# EAGLE design Adafruit_Pro_Trinket_3v3_modified (EAGLE 6.4)
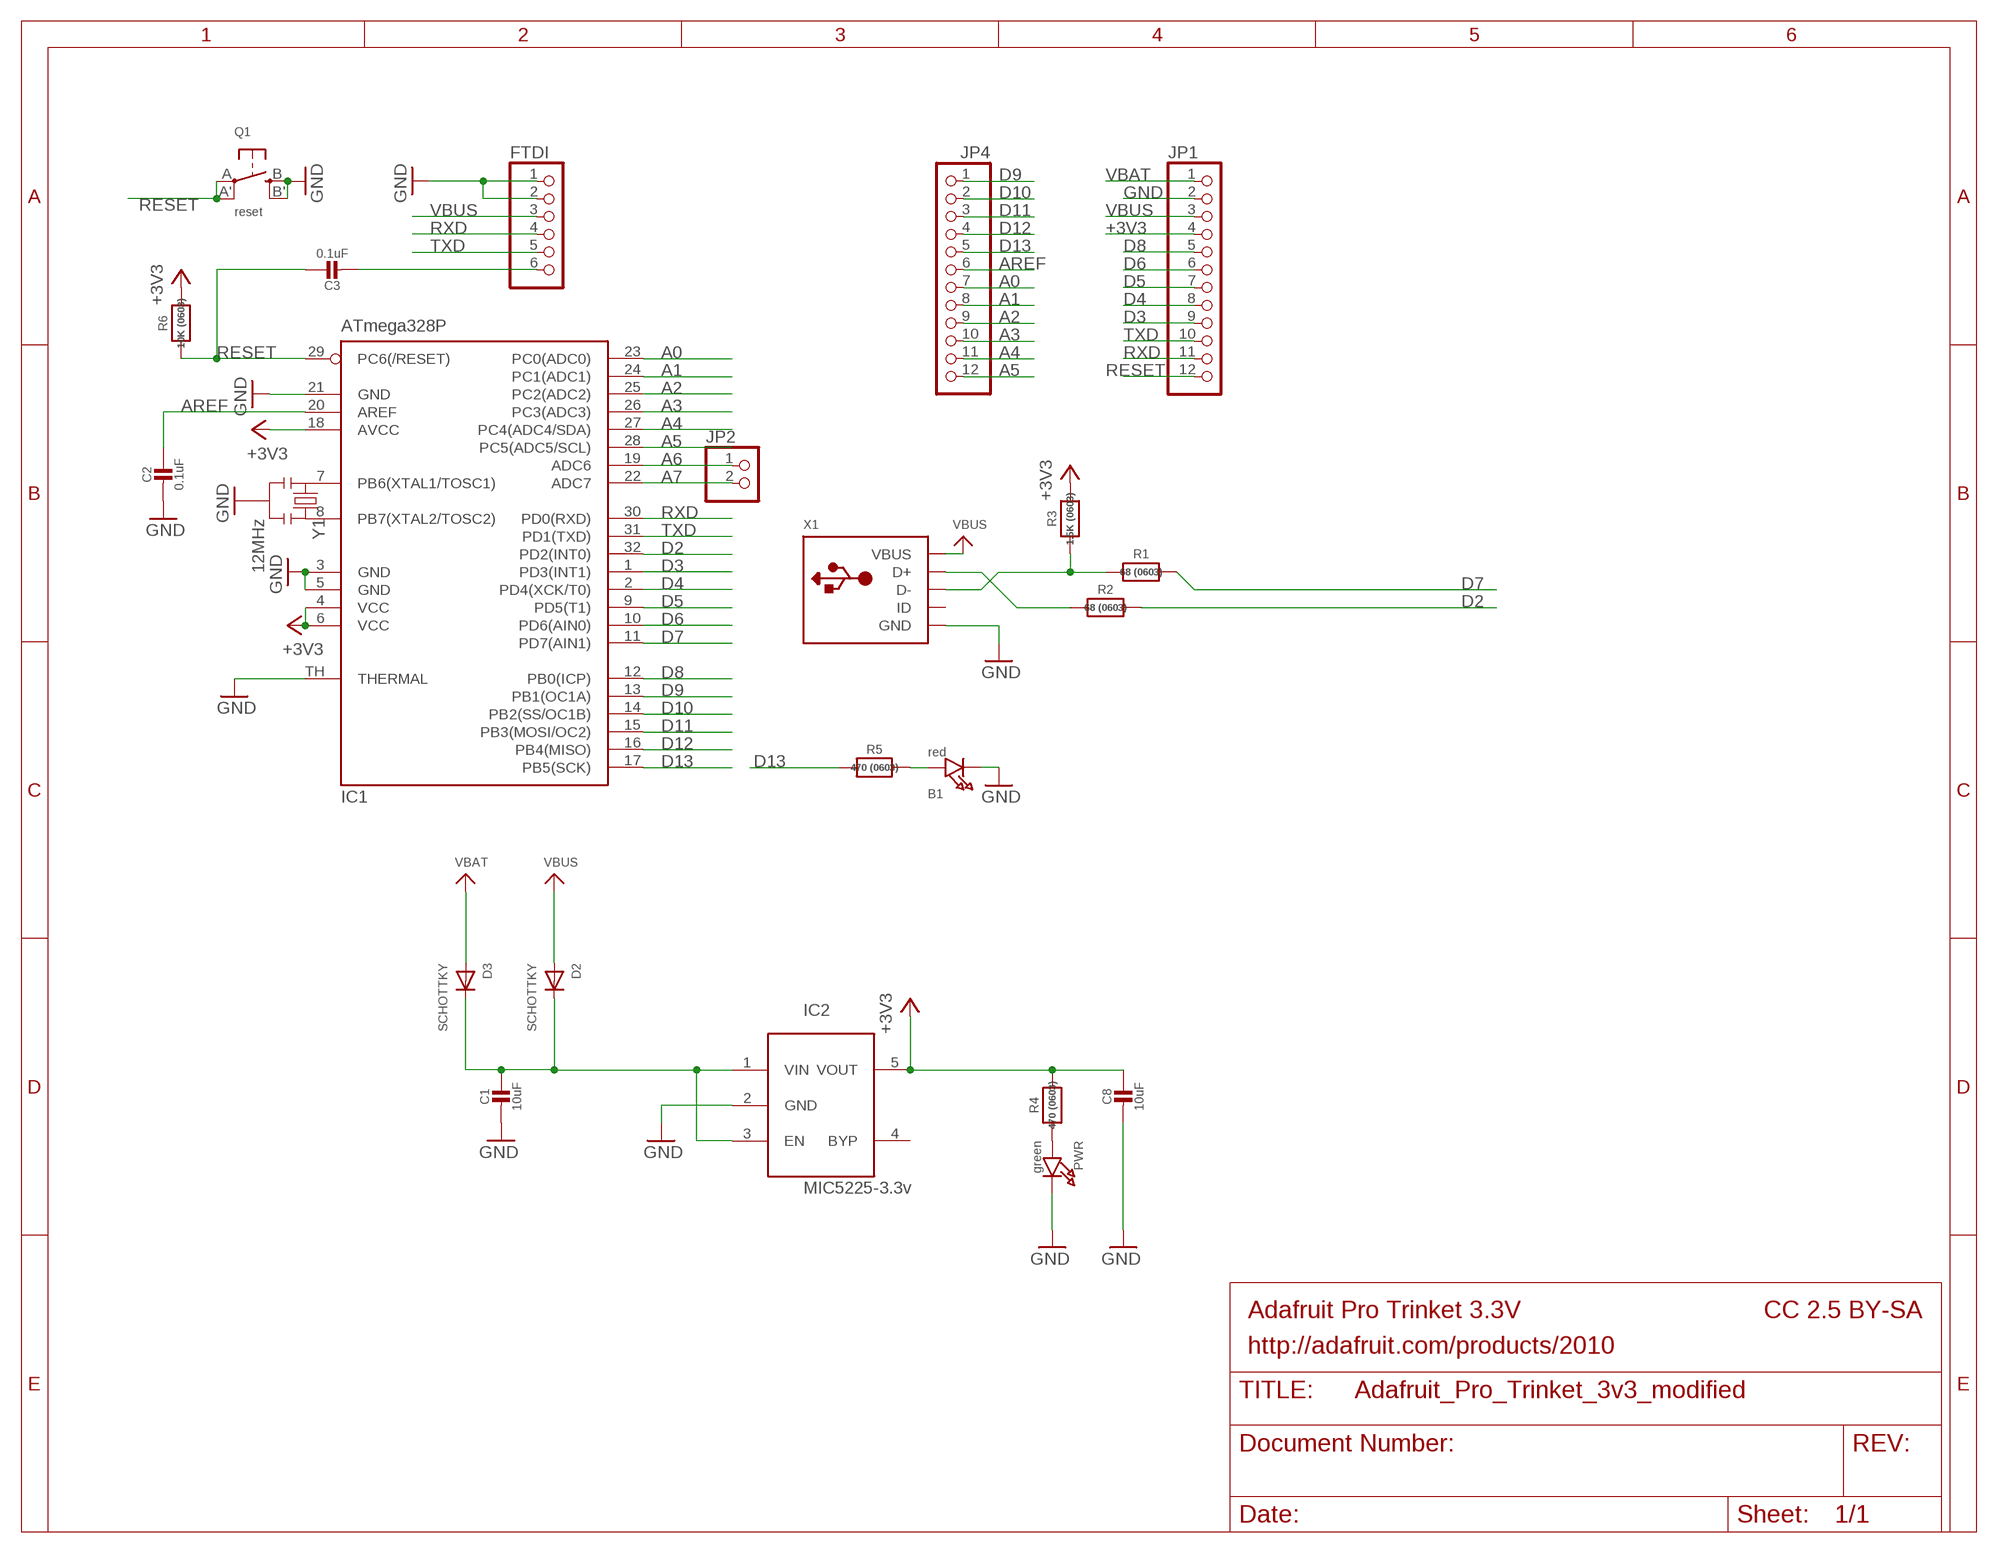
[diagram p0: schematic, sheet 1]

## Parts
B1  red  LED0805_NOOUTLINE  [CHIPLED_0805_NOOUTLINE]
C1  10uF  CAP_CERAMIC0805-NOOUTLINE  [0805-NO]
C2  0.1uF  CAP_CERAMIC_0805MP  [_0805MP]
C3  0.1uF  CAP_CERAMIC0805-NOOUTLINE  [0805-NO]
C8  10uF  CAP_CERAMIC0805-NOOUTLINE  [0805-NO]
D2  SCHOTTKY  ADAFRUIT_DIODE_SOD-123FL  [ADAFRUIT_SOD-123FL]
D3  SCHOTTKY  ADAFRUIT_DIODE_SOD-123FL  [ADAFRUIT_SOD-123FL]
FTDI  PINHD-1X6CB  [1X06-CLEANBIG]
IC1  ATmega328P  MEGA8-MI  [MLF32-TH]
IC2  MIC5225-3.3v  LP298XS  [SOT23-5L]
JP1  PINHD-1X12-CB  [1X12-CB]
JP2  HEADER-1X2ROUND  [1X02_ROUND]
JP4  PINHD-1X12-CB  [1X12-CB]
PWR  green  LED0805_NOOUTLINE  [CHIPLED_0805_NOOUTLINE]
Q1  reset  SWITCH_TACT_SMT4.6X2.8  [BTN_KMR2_4.6X2.8]
R1  68 (0603)  RESISTOR_0603_NOOUT  [0603-NO]
R2  68 (0603)  RESISTOR_0603_NOOUT  [0603-NO]
R3  1.5K (0603)  RESISTOR_0603_NOOUT  [0603-NO]
R4  470 (0603)  RESISTOR_0603_NOOUT  [0603-NO]
R5  470 (0603)  RESISTOR_0603_NOOUT  [0603-NO]
R6  10K (0603)  RESISTOR0805_NOOUTLINE  [0805-NO]
X1  MICROBUILDER_USBMICRO_20329  [MICROBUILDER_4UCONN_20329]
Y1  12MHz  RESONATORSMD  [RESONATOR-SMD]

## Nets
+3V3: C8.1 IC1.4(VCC) IC1.6(VCC) IC1.18(AVCC) IC2.5(VOUT) JP1.4 R3.2 R4.2 R6.2
A0: IC1.23(PC0(ADC0)) JP4.7
A1: IC1.24(PC1(ADC1)) JP4.8
A2: IC1.25(PC2(ADC2)) JP4.9
A3: IC1.26(PC3(ADC3)) JP4.10
A4: IC1.27(PC4(ADC4/SDA)) JP4.11
A5: IC1.28(PC5(ADC5/SCL)) JP4.12
A6: IC1.19(ADC6) JP2.1
A7: IC1.22(ADC7) JP2.2
AREF: C2.1 IC1.20(AREF) JP4.6
D2: IC1.32(PD2(INT0)) R2.2
D3: IC1.1(PD3(INT1)) JP1.9
D4: IC1.2(PD4(XCK/T0)) JP1.8
D5: IC1.9(PD5(T1)) JP1.7
D6: IC1.10(PD6(AIN0)) JP1.6
D7: IC1.11(PD7(AIN1)) R1.2
D8: IC1.12(PB0(ICP)) JP1.5
D9: IC1.13(PB1(OC1A)) JP4.1
D10: IC1.14(PB2(SS/OC1B)) JP4.2
D11: IC1.15(PB3(MOSI/OC2)) JP4.3
D12: IC1.16(PB4(MISO)) JP4.4
D13: IC1.17(PB5(SCK)) JP4.5 R5.2
D+: R2.1 X1.D+
D-: R1.1 R3.1 X1.D-
DTR/RTS: C3.2 FTDI.6
GND: B1.C C1.2 C2.2 C8.2 FTDI.1 FTDI.2 IC1.3(GND) IC1.5(GND) IC1.21(GND) IC1.TH(THERMAL) IC2.2(GND) JP1.2 PWR.C Q1.B'(S1) Q1.B(S) X1.BASE@1(GND) X1.BASE@2(GND) X1.GND X1.SPRT@1(GND) X1.SPRT@2(GND) X1.SPRT@3(GND) X1.SPRT@4(GND) Y1.2
N$1: B1.A R5.1
N$2: IC1.8(PB7(XTAL2/TOSC2)) Y1.3
N$3: IC1.7(PB6(XTAL1/TOSC1)) Y1.1
N$6: PWR.A R4.1
N$7: C1.1 D2.C D3.C IC2.1(VIN) IC2.3(EN)
RESET: C3.1 IC1.29(PC6(/RESET)) JP1.12 Q1.A'(P1) Q1.A(P) R6.1
RXD: FTDI.4 IC1.30(PD0(RXD)) JP1.11
TXD: FTDI.5 IC1.31(PD1(TXD)) JP1.10
VBAT [power]: D3.A JP1.1
VBUS: D2.A FTDI.3 JP1.3 X1.VBUS
Unconnected: IC2.4(BYP) X1.ID

## Notes on the sheet
- Adafruit Pro Trinket 3.3V | CC 2.5 BY-SA
- http://adafruit.com/products/2010

## Library data of the parts
B1 PWR = microbuilder:LED: LED 0603 - 0603 Surface Mount Package 2mA: Green LED - Low Power (3.9mcd, 2ma, 1.7Vf) - Digikey: 475-2709-2-ND Orange LED - Low Power (9.8mcd, 2ma, 1.8Vf) - Digikey: 475-1194-2-ND Red LED - Low Power (5mcd, 2ma, 1.8Vf) - Digikey: 475-1195-2-ND Yellow LED - Low Power (7mcd, 2ma, 1.8Vf) - Digikey: 475-1196-2-ND 5mA: Blue LED - Low Power (17mcd, 5ma, 2.9Vf) - Digikey: LNJ937W8CRACT-ND 0805 - 0805 Surface Mount Package 2mA: Red LED (8.8mcd, 2mA, 1.8Vf, Clear) - Low Power [Digikey: 475-2510-1-ND] Green LED (5mcd, 2mA, 1.8Vf, Clear) - Low Power [Digikey: 475-2730-1-ND] Yellow LED (11.3mcd, 2mA, 1.8Vf, Clear) - Low Power [Digikey: 475-2555-1-ND] 20mA: Red LED (104mcd, 20mA, Diffused) - LS R976 [Digikey: 475-1278-6-ND] Red LED (12mcd, 20mA, 2.0Vf, Clear) - APT2012EC [Digikey: 754-1128-1-ND] Green LED (15mcd, 20mA, 2.2Vf, Clear) - APT2012GC [Digikey: 754-1131-1-ND] Orange LED (160mcd, 20mA, 2.1Vf, Clear) - APT2012SECK [Digikey: 754-1130-1-ND] 1206 - 1206 Surface Mount Package Green LED (26mcd, 20mA, Diffused) - LG N971 [Digikey: 475-1407-6-ND] Red LED (15mcd, 20mA, Diffused) - LH N974 [Digikey: 475-1416-6-ND] Cree - Cree High-Power Surface Mount LEDs XPEBWT-L1-0000-00D50 - White 111lm 350mA 2.9Vf 6200K 110° XTEAWT-00-0000-00000LEE3 - White 114lm 350mA 2.85Vf 5000K 115° Everlight - Everlight 45-21 Series Surface Mount LEDs 45-21/QK2C-B2832AC2CB2/2T - Warm White 2000mcd 20mA 3.25Vf 3050K 120° 45-21/LK2C-B38452C4CB2/2T - Nuetral White 2000mcd 20mA 3.25Vf 4150K 120° 45-21/LK2C-B50634C6CB2/2T - Cold White 2200mcd 20mA 3.25Vf 5650K 120° PLCC2 Reverse Mount LS T77K-J1L2-1-0-2-R18-Z - Red 11.25mcd 2mA 1.8Vf 630nm 120° LO T77K-L1M2-24-Z - Orange 19.6mcd 2mA 1.8Vf 606nm 120° LY T77K-K2M1-26-Z - Yellow 15.7mcd 2mA 1.8Vf 587nm 120°
C1-C3 C8 = microbuilder:CAP_CERAMIC: Ceramic Capacitors For new designs, use the packages preceded by an '_' character since they are more reliable: The following footprints should be used on most boards: _0402 - Standard footprint for regular board layouts _0603 - Standard footprint for regular board layouts _0805 - Standard footprint for regular board layouts _1206 - Standard footprint for regular board layouts For extremely tight-pitch boards where space is at a premium, the following 'micro-pitch' footprints can be used (smaller pads, no silkscreen outline, etc.): _0402MP - Micro-pitch footprint for very dense/compact boards _0603MP - Micro-pitch footprint for very dense/compact boards _0805MP - Micro-pitch footprint for very dense/compact boards _1206MP - Micro-pitch footprint for very dense/compact boards
D2 D3 = Adafruit Pro Trinket 3v3:ADAFRUIT_DIODE: Diode SMADIODE - SMA Surface Mount Package 20V 1A Schottky Diode Digikey: 641-1014-6-ND DO-1N4148 - Through Hole Small Current Diode SOD-123 20V 1 A (.5mV Vf) Schottky Diode - Digikey: MBRX120TPMSCT-ND SOD-323 10V 570mA (.38mV Vf, 3ns) Schottky Diode - Digikey: ZLLS410CT-ND SOD-523 30V 30mA Schottky Diode (RB751S-40TE61) - Digikey: RB751S-40TE61CT-ND SOT23-R/W - SOT23 Package (R = Solder Paste/Reflow Ovens, W = Hand-Soldering) BAT54Film 40V 300mA - Digikey: 497-7162-1-ND
FTDI = adafruit:PINHD-1X6: PIN HEADER
IC1 = microbuilder:MEGA8-MI: MICROCONTROLLER 8 Kbytes FLASH, 1 kbytes SRAM, 512 bytes EEPROM, USART, 6-channel 10 bit ADC, 2-channel 8 bit ADC Pin compatible with Atmega48, ATMega88, ATMega168 Source: avr.lbr; MPN: ATMEGA88PA-MU; OC_FARNELL: 1715491; OC_NEWARK: 15R0272
IC2 = adafruit:LP298X
JP1 JP4 = adafruit:PINHD-1X12: PIN HEADER
JP2 = microbuilder:HEADER-1X2: PIN HEADER
Q1 = microbuilder:SWITCH_TACT_SMT: SMT Tact Switches 6x6mm - Digikey: P12940SCT-ND KMR2 (4.6x2.8mm) - Digikey: 401-1426-1-ND EVQ-PQHB55 - Light Touch, 160GF (4.5x4.5mm) - Digikey: P8090SCT-ND KMT0 - KMT021 NGJ LHS (etc.) IP68/Waterproof - Digikey: CKN10289CT-ND
R1-R6 = microbuilder:RESISTOR: Resistors For new designs, use the packages preceded by an '_' character since they are more reliable: The following footprints should be used on most boards: _0402 - Standard footprint for regular board layouts _0603 - Standard footprint for regular board layouts _0805 - Standard footprint for regular board layouts _1206 - Standard footprint for regular board layouts For extremely tight-pitch boards where space is at a premium, the following 'micro-pitch' footprints can be used (smaller pads, no silkscreen outline, etc.): _0402MP - Micro-pitch footprint for very dense/compact boards _0603MP - Micro-pitch footprint for very dense/compact boards _0805MP - Micro-pitch footprint for very dense/compact boards _1206MP - Micro-pitch footprint for very dense/compact boards
X1 = Adafruit Pro Trinket 3v3:MICROBUILDER_USB: USB Connectors USBMINIB - Surface Mount Female Mini-B USB Connector 4UConnector: 06564
Y1 = SparkFun:RESONATOR: Resonator Small SMD resonator. This is the itty bitty 10/20MHz resonators with built in caps. CSTCE10M0G55 and CSTCE20M0V53. Footprint has been reviewed closely but hasn't been tested yet.

## Net classes
1 power: width 0.305 mm

## Board
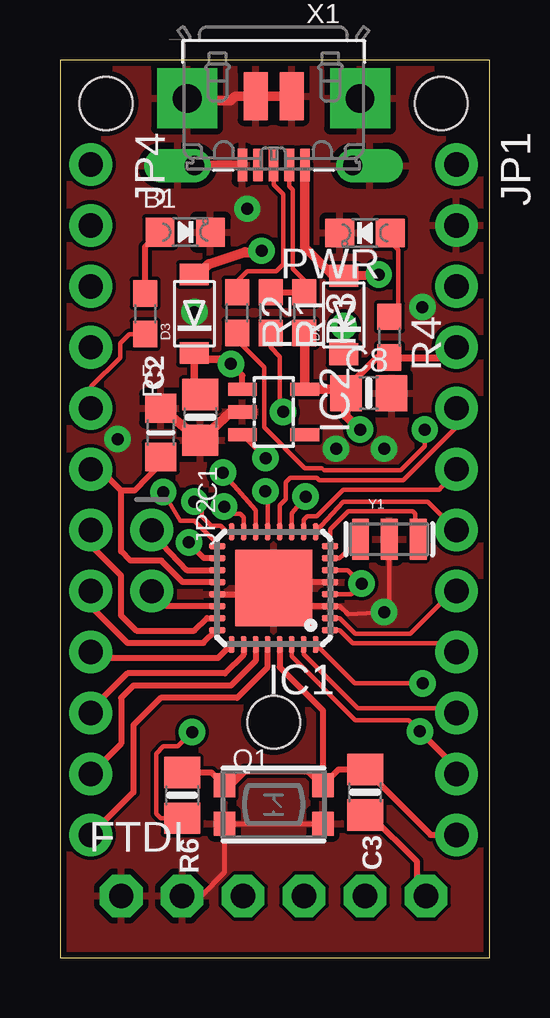
[diagram p1: board, top side]
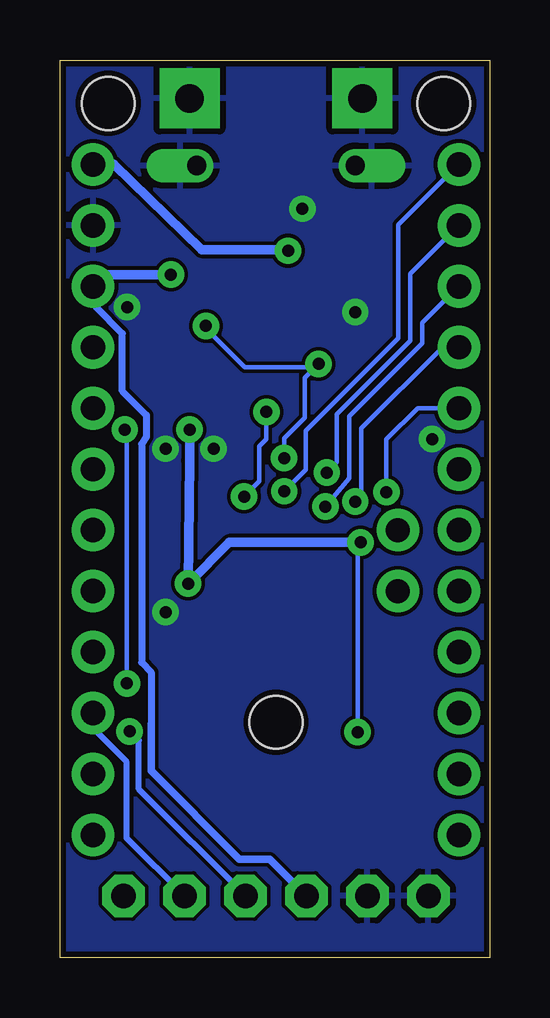
[diagram p2: board, bottom side, seen from below]

Size 17.9 x 37.4 mm. Coordinates in mm from the lower left corner, seen from the top.
Outline: 17.9,0 17.9,37.4 0,37.4 0,0 17.9,0
Copper layers (1*16): Top 0.035mm / dielectric 1.5mm / Bottom 0.035mm
Design rules "drirr": minimum track width 0.15mm, minimum drill 0.5mm, track to track 0.15mm, track to pad 0.15mm, pad to pad 0.15mm, via to via 0.15mm, smd to smd 0.15mm, copper to edge 10mil, drill to drill 8mil, minimum pad ring 0.3mm, minimum via ring 0.3mm, stop-mask expansion 4mil, vias tented up to drill 0mil, thermal gap 10mil
Holes 2.2 mm at 1.92,35.59 15.88,35.59 8.9,9.81

### Footprints (pad centres in the part's own frame; a part is rotated, then mirrored left to right if it is on the bottom)
CHIPLED_0805_NOOUTLINE = smd 1.2 x 1.2: A 0,-1.05; C 0,1.05
0805-NO = smd 1.3 x 1.5: 1 -0.95,0; 2 0.95,0
_0805MP = smd 1.2 x 1.3: 1 -1.016,0; 2 1.016,0
ADAFRUIT_SOD-123FL = smd 0.91 x 1.22: A 1.637,0; C -1.637,0
1X06-CLEANBIG = drill 1.016 pad 1.778 octagon: 1 -6.35,0; 2 -3.81,0; 3 -1.27,0; 4 1.27,0; 5 3.81,0; 6 6.35,0
MLF32-TH = smd 0.7 x 0.25: 1 -2.35,1.75; 2 -2.35,1.25; 3 -2.35,0.75; 4 -2.35,0.25; 5 -2.35,-0.25; 6 -2.35,-0.75; 7 -2.35,-1.25; 8 -2.35,-1.75; 17 2.35,-1.75; 18 2.35,-1.25; 19 2.35,-0.75; 20 2.35,-0.25; 21 2.35,0.25; 22 2.35,0.75; 23 2.35,1.25; 24 2.35,1.75 | smd 0.25 x 0.7: 9 -1.75,-2.35; 10 -1.25,-2.35; 11 -0.75,-2.35; 12 -0.25,-2.35; 13 0.25,-2.35; 14 0.75,-2.35; 15 1.25,-2.35; 16 1.75,-2.35; 25 1.75,2.35; 26 1.25,2.35; 27 0.75,2.35; 28 0.25,2.35; 29 -0.25,2.35; 30 -0.75,2.35; 31 -1.25,2.35; 32 -1.75,2.35 | smd 3.2 x 3.2: TH 0,0
SOT23-5L = smd 0.55 x 1.2: 1 -0.95,-1.3; 2 0,-1.3; 3 0.95,-1.3; 4 0.95,1.3; 5 -0.95,1.3
1X12-CB = drill 1.016 pad 1.778: 1 -13.97,0; 2 -11.43,0; 3 -8.89,0; 4 -6.35,0; 5 -3.81,0; 6 -1.27,0; 7 1.27,0; 8 3.81,0; 9 6.35,0; 10 8.89,0; 11 11.43,0; 12 13.97,0
1X02_ROUND = drill 1 pad 1.778: 1 -1.27,0; 2 1.27,0
BTN_KMR2_4.6X2.8 = smd 0.9 x 1: A 2.05,0.8; A' -2.05,0.8; B 2.05,-0.8; B' -2.05,-0.8
0603-NO = smd 1.1 x 1: 1 -0.85,0; 2 0.85,0
MICROBUILDER_4UCONN_20329 = smd 1 x 2: BASE@1 -0.75,-2; BASE@2 0.75,-2 | smd 0.4 x 1.35: D+ 0,0.875; D- -0.65,0.875; GND 1.3,0.875; ID 0.65,0.875; VBUS -1.3,0.875 | drill 0.8 offset: SPRT@1 -3.3,0.9; SPRT@2 3.3,0.9 | drill 1.2 pad 2.5 square: SPRT@3 -3.6,-1.9; SPRT@4 3.6,-1.9
RESONATOR-SMD = smd 0.7 x 1.7: 1 -1.2,0; 2 0,0; 3 1.2,0

### Placement (x,y rotation side)
B1  5.22,30.23 270 top
C1  5.85,22.51 270 top
C2  4.2,21.87 90 top
C3  12.71,6.89 270 top
C8  12.86,23.52 0 top
D2  11.82,26.78 90 top
D3  5.6,26.83 90 top
FTDI  8.9,2.57 0 top
IC1  8.9,15.4 180 top
IC2  8.9,22.74 270 top
JP1  16.52,19.08 270 top
JP2  3.82,16.54 270 top
JP4  1.28,19.08 270 top
PWR  12.71,30.19 90 top
Q1  8.9,6.38 0 top
R1  8.77,26.87 270 top
R2  7.38,26.87 270 top
R3  10.17,26.87 270 top
R4  13.73,25.85 270 top
R5  3.55,26.83 270 top
R6  5.09,6.76 270 top
X1  8.9,33.9 180 top
Y1  13.72,17.43 0 top

### Tracks (layer width: path | path; a pad name or v marks a point on that pad's centre or on a via)
+3V3  (via drill 0.5)
  Top 0.18: IC1.4 12.13,15.15 v12.56,15.58 12,16.15 IC1.6 | R6.2 4.19,5.81 4,6 4,8.5 4.3,8.8 4.9,8.8 v5.5,9.4
  Top 0.254: IC1.18 6,16.65 5.47,17.18
  Top 0.3: 11.75,23.68 C8.1 12.4,24.01 12.4,24.2 13.2,25 R4.2 | 13.8,25 16.09,25 JP1.4
  Top 0.305: 5.47,17.18 v5.37,17.3
  Top 0.4: 10.2,25.69 IC2.5 | R4.2 13.8,25 | C8.1 11.91,22.59 v12.5,22 | 10.3,23.68 11.75,23.68
  Top 0.406: 10.3,23.68 IC2.5 | R3.2 10.2,25.69
  Bottom 0.18: v5.5,9.4 5.5,17.17 v5.37,17.3
  Bottom 0.4: v5.37,17.3 10.84,17.3 v12.56,15.58 12.5,20.72 v12.5,22
A0
  Top 0.254: IC1.23 6.13,14.15 5.6,13.62 3.19,13.62 2.55,14.25 2.55,15.9 1.28,17.18 JP4.7
A1
  Top 0.254: JP4.8 1.28,14.63 2.8,13.11 5.98,13.11 6.51,13.65 IC1.24
A2
  Top 0.254: 7.15,12.88 IC1.25 6.58,12.48 1.53,12.48 JP4.9
A3
  Top 0.254: JP4.10 1.28,10.32 2.8,11.84 6.87,11.84 7.65,12.62 IC1.26
A4
  Top 0.254: JP4.11 2.55,8.92 2.55,10.82 3.06,11.33 7.12,11.33 8.15,12.36 IC1.27
A5
  Top 0.254: IC1.28 8.65,12.1 7.38,10.82 4.2,10.82 3.06,9.68 3.06,6.89 JP4.12
A6
  Top 0.254: JP2.1 3.82,17.68 3.9,17.6 5.28,16.15 IC1.19
A7
  Top 0.254: IC1.22 4.44,14.65 JP2.2
AREF
  Top 0.254: IC1.20 5.12,15.65 4.23,16.54 2.93,16.54 2.55,16.92 2.55,19.46 | 2.55,19.46 1.66,20.35 JP4.6 | 2.55,19.46 3.1,19.46 4.24,20.64 C2.1
D2  (via drill 0.5)
  Top 0.18: v15.11,11.42 12.28,11.42 IC1.32 | R2.2 7.38,25.72 8.5,24.6 8.5,22.1 10.2,20.4 10.9,20.4 11,20.3 14.2,20.3 15.2,21.3 v15.2,22
  Bottom 0.18: v15.11,11.42 15.11,21.91 v15.2,22
D3
  Top 0.18: IC1.1 11.65,13.65 12.2,13.1 16.15,13.1 JP1.9
D4
  Top 0.18: IC1.2 11.65,14.15 12.3,13.5 14.6,13.5 16.4,15.3 16.49,15.3 JP1.8
D5
  Top 0.18: IC1.9 11.8,19 15.33,19 JP1.7
D6
  Top 0.18: JP1.6 15.8,19.5 11.8,19.5 10.7,18.4 10.3,18.4 10.15,18.25 IC1.10
D7  (via drill 0.5)
  Top 0.18: R1.2 8.77,25.42 9.15,25.04 9.15,22.88 v9.3,22.74 | IC1.11 9.65,18.52 v10.23,19.21
  Bottom 0.18: v9.3,22.74 v9.3,22.73 9.3,21.6 9.6,21.3 9.6,19.84 v10.23,19.21
D8
  Top 0.18: IC1.12 9.15,18.85 9.4,19.1 9.4,19.8 9.6,20 10.7,20 10.8,19.9 14.3,19.9 14.4,20 16.5,22.1 16.5,22.87 JP1.5
  Top 0.254: JP1.5 16.52,22.51
D9  (via drill 0.5)
  Top 0.18: IC1.13 8.65,19.34 v8.56,19.43
  Bottom 0.18: v8.56,19.43 7.66,20.33 7.66,21.94 3.8,25.8 3.8,30.53 JP4.1
D10  (via drill 0.5)
  Top 0.18: IC1.14 8.15,18.64 v6.78,20.21
  Bottom 0.18: v6.78,20.21 6.36,20.63 6.36,22.64 3.3,25.7 3.3,28.49 JP4.2
D11  (via drill 0.5)
  Top 0.18: IC1.15 7.65,18.35 7.5,18.5 7.13,18.5 v6.84,18.79
  Bottom 0.18: v6.84,18.79 5.85,19.98 5.85,22.55 2.8,25.6 2.8,26.45 JP4.3
D12  (via drill 0.5)
  Top 0.18: IC1.16 6.95,17.75 6.7,18 6.3,18 5.9,18.4 5.9,18.7 v5.6,19
  Bottom 0.18: v5.6,19 5.34,19.26 5.34,22.06 2,25.4 1.31,25.4 JP4.4
D13  (via drill 0.5)
  Top 0.18: v4.3,19.4 5,18.2 5.6,18.2 6.55,17.25 IC1.17 | R5.2 2.88,25.98 2.5,25.6 2.5,25 1.3,23.8 1.3,22.91 JP4.5
  Bottom 0.18: v4.3,19.4 4.3,21.6 3,22.9 JP4.5
D+
  Top 0.18: X1.D+ 8.9,32.2 9.3,31.8 9.3,28.9 9,28.6 7.8,28.6 7.4,28.2 7.4,27.75 R2.1
D-
  Top 0.18: X1.D- 9.55,32.15 9.7,32 9.7,28.7 10.2,28.2 10.2,27.75 R3.1
  Top 0.254: R1.1 R3.1
DTR/RTS
  Top 0.254: FTDI.6 14.87,2.95 14.87,4.01 12.94,5.94 C3.2
GND  (via drill 0.5)
  Top 0.18: Y1.2 13.72,14.62 v13.5,14.4 | 13.4,14.3 v13.5,14.4 | IC1.3 11.65,14.65 12,14.3 v13.5,14.4
  Top 0.2: 8.65,15.15 IC1.TH | 9.15,15.65 IC1.TH | 9.65,14.65 IC1.TH | FTDI.2 5.12,2.6 5.9,2.6 6.85,3.55 Q1.B' Q1.B | IC1.TH
  Top 0.25: IC1.21 8.65,15.15 | IC1.5 9.15,15.65 | IC1.3 9.65,14.65
  Top 0.4: C2.2 4.22,22.89 C1.2 7.13,22.74 IC2.2 | X1.GND 5.62,33.02 X1.SPRT@2 | X1.BASE@1 X1.BASE@2 7.3,35.9 7.1,35.7 5.4,35.7 X1.SPRT@4
  other vias: 2.4,21.6 7.8,31.2 11.5,21.2 15.1,27.1 13.5,21.2 5.6,26.9
  pour Bottom: 0,37.4 0,0 17.9,0 17.9,37.4
  pour Top: 0,0 18,0 18,37 0,37
N$1
  Top 0.254: R5.1 3.55,29.61 B1.A
N$2
  Top 0.18: IC1.8 11.25,17.85 12,18.6 14.7,18.6 14.8,18.5 14.8,17.45 Y1.3
N$3
  Top 0.18: IC1.7 11.64,16.65 Y1.1
N$6
  Top 0.18: PWR.A 13.76,29.84 14.1,29.5 14.1,27.18 R4.1
N$7  (via drill 0.5)
  Top 0.18: IC2.3 7.69,21.69 v8.56,20.81
  Top 0.254: IC2.1 7.6,24.26 v7.12,24.74 | D2.C 11.95,25.01 11.82,24.92 v11.82,26.32 | 5.72,24.94 5.6,25.06 D3.C
  Top 0.305: C1.1 5.6,23.71 D3.C | 5.72,24.94 6.82,24.94 v7.12,24.74
  Bottom 0.18: v8.56,20.81 8.56,21.64 7.7,22.5 7.7,24.16 v7.12,24.74 7.26,24.6 10.2,24.6 11.82,26.22 v11.82,26.32
RESET
  Top 0.254: IC1.29 9.15,12.1 10.95,10.3 Q1.A 11.61,7.84 C3.1 15.44,5.11 JP1.12 | Q1.A' 6.32,7.71 R6.1
  Top 0.305: Q1.A 10.35,7.78 7.7,7.78 7.1,7.18 Q1.A'
RXD  (via drill 0.5)
  Top 0.18: IC1.30 9.65,12.55 12.3,9.9 14.52,9.9 v15,9.43
  Top 0.254: v15,9.43 16.52,7.9 JP1.11
  Bottom 0.254: FTDI.4 14.62,7.01 14.62,9.05 v15,9.43
TXD
  Top 0.18: IC1.31 10.15,12.65 12.4,10.4 16.31,10.4 JP1.10
  Bottom 0.254: FTDI.5 15.12,4.98 15.12,8.16 16.52,9.55 JP1.10
VBAT  (via drill 0.5)
  Top 0.406: D3.A 5.76,28.46 6.2,28.9 7.7,29.4 8.1,29.4 v8.4,29.45
  Bottom 0.4: JP1.1 15.65,33.05 12,29.5 8.65,29.5 v8.4,29.45
VBUS  (via drill 0.5)
  Top 0.4: X1.VBUS 10.2,29.6 11.3,28.5 11.73,28.5 D2.A 12.44,28.41 v13.28,28.46
  Top 0.406: 11.76,28.48 D2.A
  Bottom 0.25: JP1.3 16.27,27.97 | 14.1,9.75 14.11,9.74
  Bottom 0.3: 14.1,9.75 14.1,11.9 14.5,12.3 14.5,21.4 14.3,21.7 14.3,22.6 15.3,23.6 15.3,26 16.4,27.1 16.4,27.85 JP1.3
  Bottom 0.305: FTDI.3 9.15,4.09 10.42,4.09 14.11,7.78 14.11,9.74
  Bottom 0.4: v13.28,28.46 16.03,28.46 JP1.3